# EAGLE design MDD (EAGLE 8.5.1)
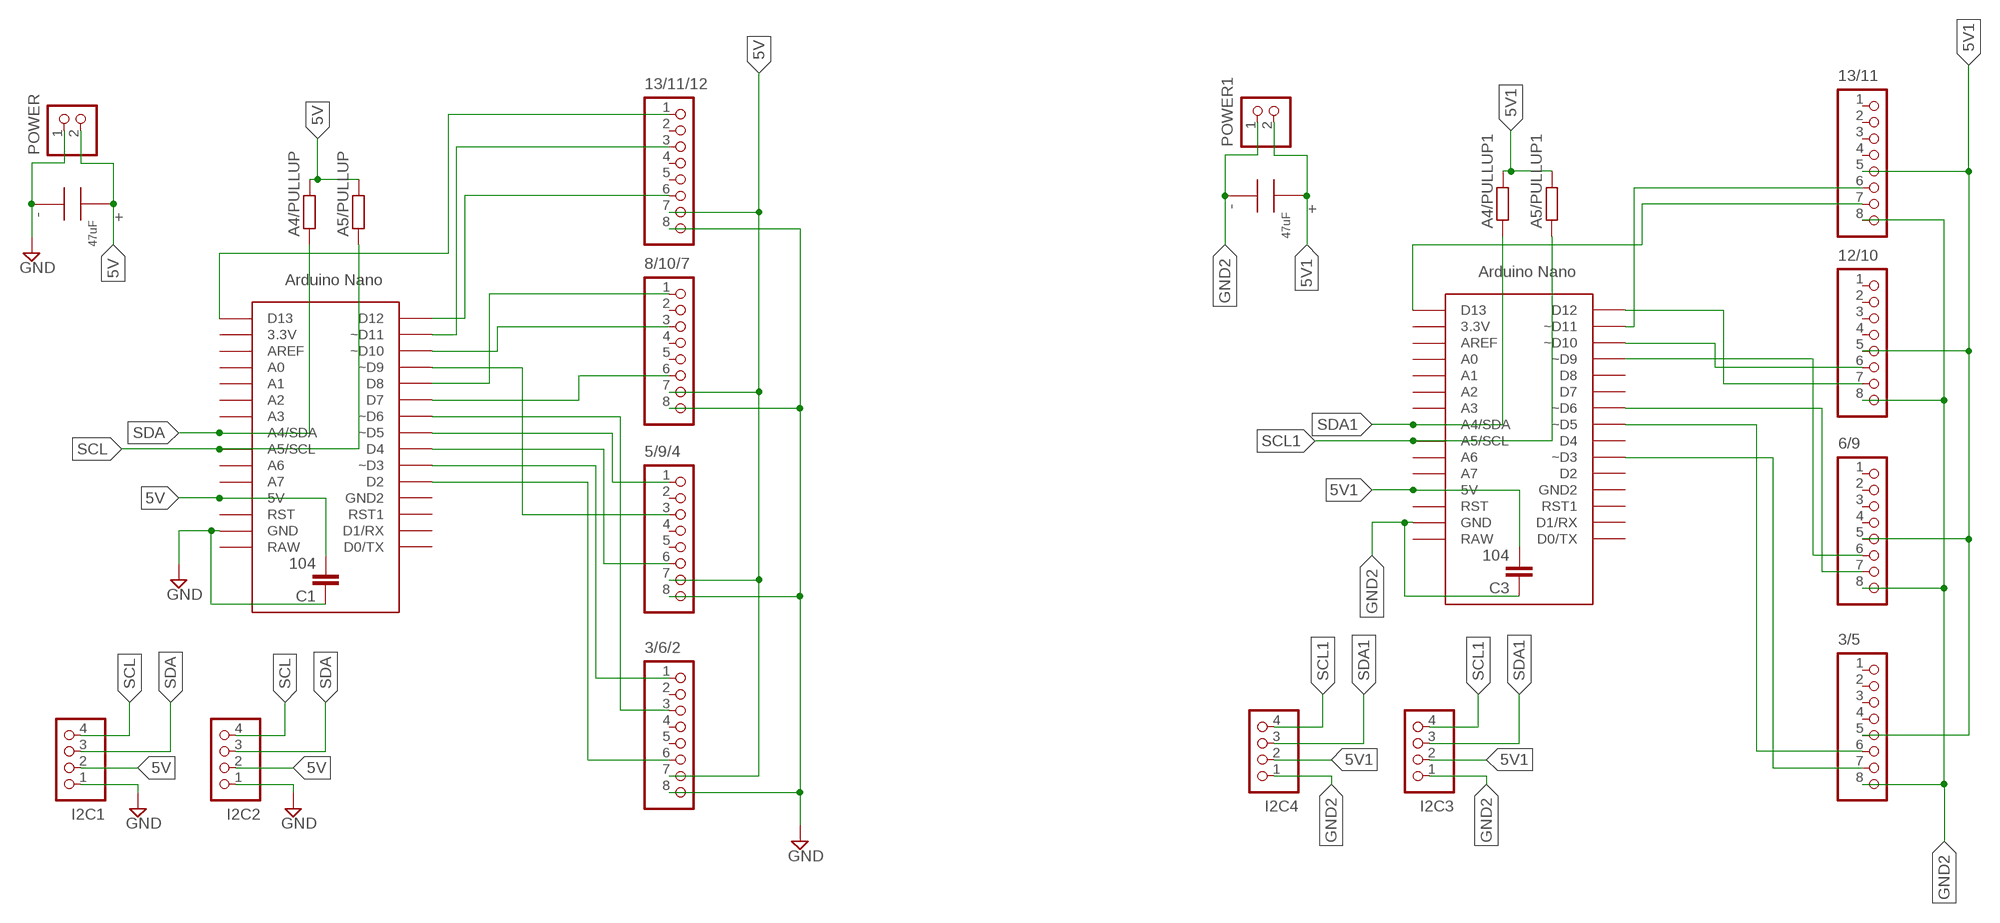
[diagram p0: schematic, sheet 1]

## Parts
3/5  B8B-XH-A  [B8B-XH-A]
3/6/2  B8B-XH-A  [B8B-XH-A]
5/9/4  B8B-XH-A  [B8B-XH-A]
6/9  B8B-XH-A  [B8B-XH-A]
8/10/7  B8B-XH-A  [B8B-XH-A]
12/10  B8B-XH-A  [B8B-XH-A]
13/11  B8B-XH-A  [B8B-XH-A]
13/11/12  B8B-XH-A  [B8B-XH-A]
A4/PULLUP  R-EU_0204/7  [0204/7]
A4/PULLUP1  R-EU_0204/7  [0204/7]
A5/PULLUP  R-EU_0204/7  [0204/7]
A5/PULLUP1  R-EU_0204/7  [0204/7]
C1  104  C2.5/2  [C2.5-2]
C2  47uF  C_47UF  [C_47UF]
C3  104  C2.5/2  [C2.5-2]
C4  47uF  C_47UF  [C_47UF]
I2C1  B4B-XH-A  [B4B-XH-A]
I2C2  B4B-XH-A  [B4B-XH-A]
I2C3  B4B-XH-A  [B4B-XH-A]
I2C4  B4B-XH-A  [B4B-XH-A]
NANO  NANO  [NANO]
NANO1  NANO  [NANO]
POWER  B2B-XH-A  [B2B-XH-A]
POWER1  B2B-XH-A  [B2B-XH-A]

## Nets
5V [power]: 3/6/2.7 5/9/4.7 8/10/7.7 13/11/12.7 A4/PULLUP.2 A5/PULLUP.2 C1.2 C2.+ I2C1.2 I2C2.2 NANO.5V POWER.2(VCC)
5V1 [power]: 3/5.5 6/9.5 12/10.5 13/11.5 A4/PULLUP1.2 A5/PULLUP1.2 C3.2 C4.+ I2C3.2 I2C4.2 NANO1.5V POWER1.2(VCC)
GND [power]: 3/6/2.8 5/9/4.8 8/10/7.8 13/11/12.8 C1.1 C2.- I2C1.1 I2C2.1 NANO.GND POWER.1(GND)
GND2 [power]: 3/5.8 6/9.8 12/10.8 13/11.8 C3.1 C4.- I2C3.1 I2C4.1 NANO1.GND POWER1.1(GND)
N$1: 13/11/12.1 NANO.D13
N$2: 13/11/12.3 NANO.D11(~D11)
N$3: 13/11/12.6 NANO.D12
N$4: 8/10/7.3 NANO.D10(~D10)
N$5: 8/10/7.1 NANO.D8
N$6: 5/9/4.3 NANO.D9(~D9)
N$7: 8/10/7.6 NANO.D7
N$8: 3/6/2.3 NANO.D6(~D6)
N$9: 5/9/4.1 NANO.D5(~D5)
N$10: 5/9/4.6 NANO.D4
N$11: 3/6/2.1 NANO.D3(~D3)
N$12: 3/6/2.6 NANO.D2
N$13: 13/11.7 NANO1.D13
N$14: 6/9.7 NANO1.D6(~D6)
N$16: 3/5.7 NANO1.D3(~D3)
N$17: 3/5.6 NANO1.D5(~D5)
N$18: 6/9.6 NANO1.D9(~D9)
N$19: 12/10.6 NANO1.D10(~D10)
N$20: 12/10.7 NANO1.D12
N$21: 13/11.6 NANO1.D11(~D11)
SCL: A5/PULLUP.1 I2C1.4 I2C2.4 NANO.A5(A5/SCL)
SCL1: A5/PULLUP1.1 I2C3.4 I2C4.4 NANO1.A5(A5/SCL)
SDA: A4/PULLUP.1 I2C1.3 I2C2.3 NANO.A4(A4/SDA)
SDA1: A4/PULLUP1.1 I2C3.3 I2C4.3 NANO1.A4(A4/SDA)
Unconnected: 3/5.1 3/5.2 3/5.3 3/5.4 3/6/2.2 3/6/2.4 3/6/2.5 5/9/4.2 5/9/4.4 5/9/4.5 6/9.1 6/9.2 6/9.3 6/9.4 8/10/7.2 8/10/7.4 8/10/7.5 12/10.1 12/10.2 12/10.3 12/10.4 13/11.1 13/11.2 13/11.3 13/11.4 13/11/12.2 13/11/12.4 13/11/12.5 NANO1.3.3V NANO1.A0 NANO1.A1 NANO1.A2 NANO1.A3 NANO1.A6 NANO1.A7 NANO1.AREF NANO1.D2 NANO1.D4 NANO1.D7 NANO1.D8 NANO1.GND1(GND2) NANO1.RAW NANO1.RST NANO1.RST1 NANO1.RX1(D1/RX) NANO1.TX0(D0/TX) NANO.3.3V NANO.A0 NANO.A1 NANO.A2 NANO.A3 NANO.A6 NANO.A7 NANO.AREF NANO.GND1(GND2) NANO.RAW NANO.RST NANO.RST1 NANO.RX1(D1/RX) NANO.TX0(D0/TX)

## Library data of the parts
3/5 3/6/2 5/9/4 6/9 8/10/7 12/10 13/11 13/11/12 = jst-xh:B8B-XH-A: Wire-to-Board 2.5mm pitch top mount connector Source: http://www.jst-mfg.com/product/pdf/jpn/XH.pdf http://www.jst-mfg.com/product/detail.php?series=277
A4/PULLUP A4/PULLUP1 A5/PULLUP A5/PULLUP1 = resistor:R-EU_: RESISTOR, European symbol
C1 C3 = capacitor-wima:C: CAPACITOR naming: grid - package width
C2 C4 = c_47uF:C_47UF: 47uF
I2C1-I2C4 = jst-xh:B4B-XH-A: Wire-to-Board 2.5mm pitch top mount connector Source: http://www.jst-mfg.com/product/pdf/jpn/XH.pdf http://www.jst-mfg.com/product/detail.php?series=277
NANO NANO1 = Arduino-clone:NANO: Arduino Nano
POWER POWER1 = jst-xh:B2B-XH-A: Wire-to-Board 2.5mm pitch top mount connector Source: http://www.jst-mfg.com/product/pdf/jpn/XH.pdf http://www.jst-mfg.com/product/detail.php?series=277

## Net classes
0 default: width 0.3 mm
1 power: width 0.5 mm

## Board
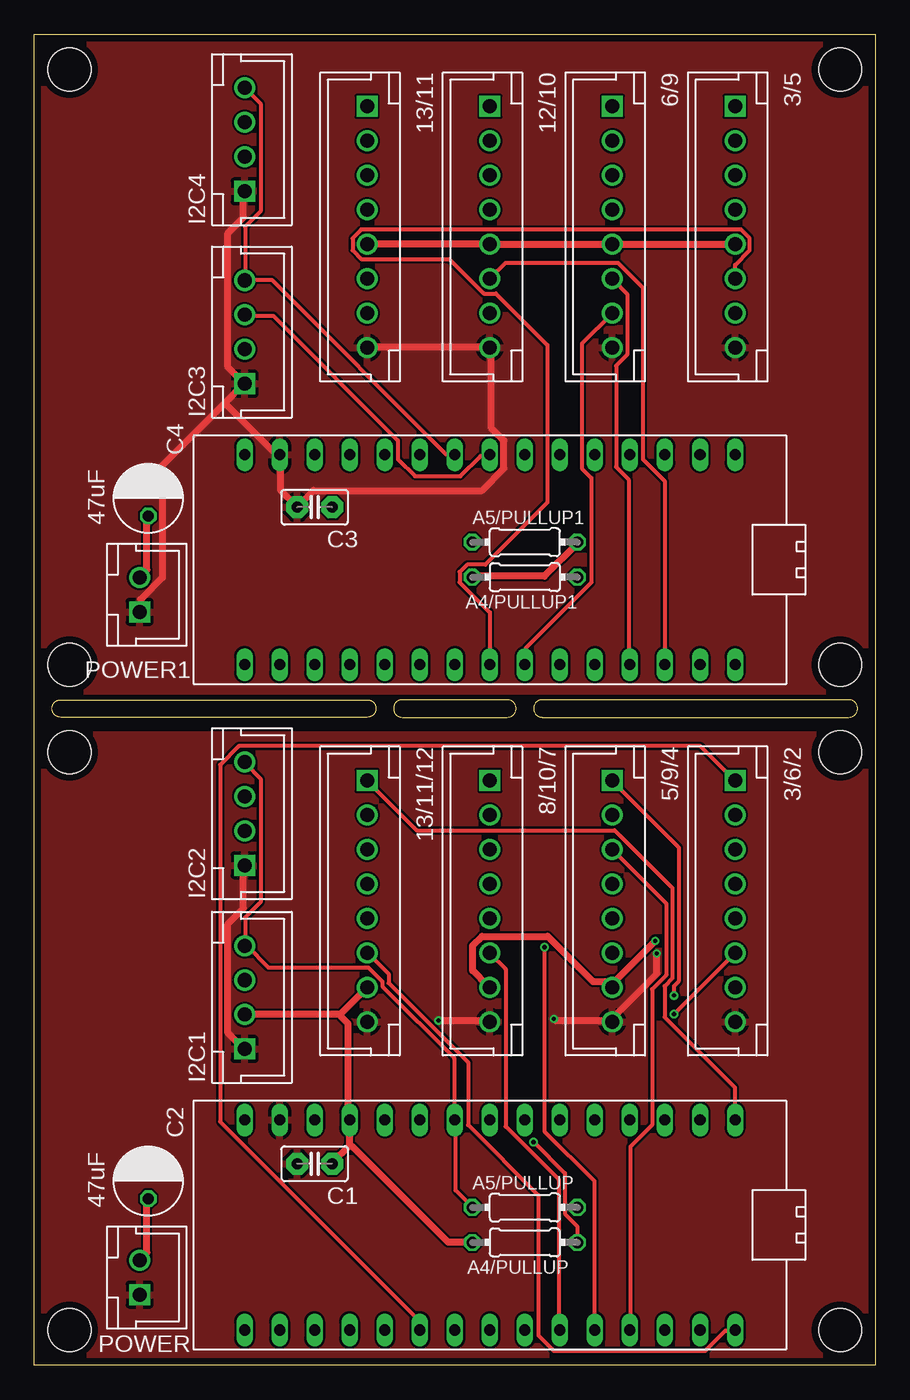
[diagram p1: board, top side]
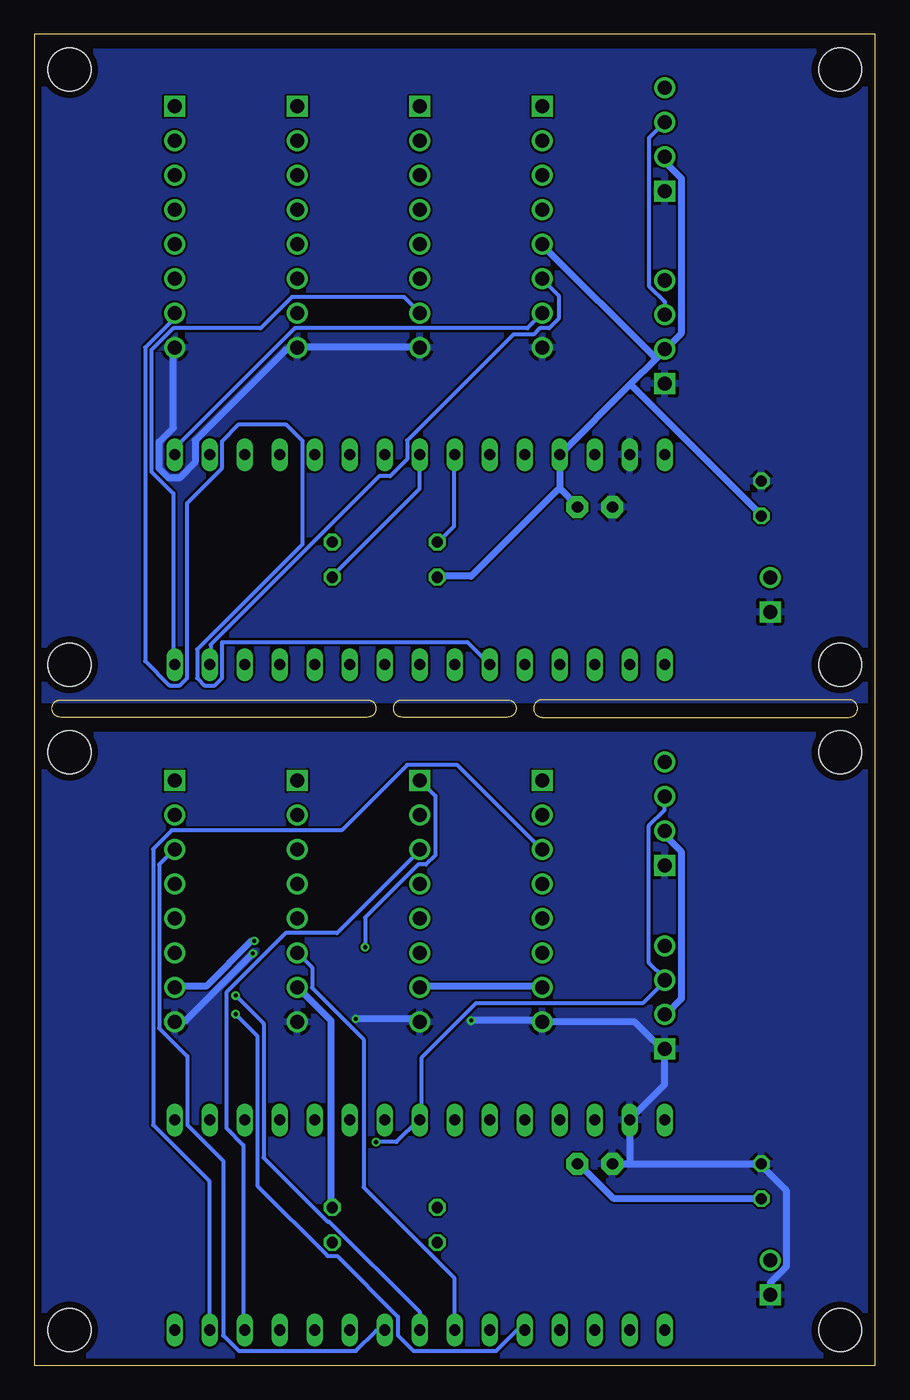
[diagram p2: board, bottom side, seen from below]

Size 60.96 x 96.52 mm. Coordinates in mm from the lower left corner, seen from the top.
Outline: 0,0 0,96.52 60.96,96.52 60.96,0 0,0
Copper layers (1*16): Top 0.035mm / dielectric 1.6mm / Bottom 0.035mm
Design rules "Elecrow_2-layer_PCB_eagle_rule": minimum track width 6mil, minimum drill 12mil, track to track 6mil, track to pad 6mil, pad to pad 6mil, via to via 8mil, smd to smd 0mil, copper to edge 20mil, drill to drill 10mil, minimum pad ring 6mil, minimum via ring 6mil, stop-mask expansion 0mil, vias tented up to drill 100mil, thermal gap 10mil
Holes 3.1 mm at 2.54,2.54 2.54,50.8 58.42,93.98 2.54,44.45 58.42,50.8 2.54,93.98 58.42,2.54 58.42,44.45
Milling: area 1.3,47 to 24.8,48.3; area 26,47 to 34.9,48.3; area 36.2,47 to 59.7,48.3

### Footprints (pad centres in the part's own frame; a part is rotated, then mirrored left to right if it is on the bottom)
B8B-XH-A = drill 1.016 square: 1 -8.75,0 | drill 1.016: 2 -6.25,0; 3 -3.75,0; 4 -1.25,0; 5 1.25,0; 6 3.75,0; 7 6.25,0; 8 8.75,0
0204/7 = drill 0.813 octagon: 1 -3.81,0; 2 3.81,0
C2.5-2 = drill 0.813 pad 1.6 octagon: 1 -1.27,0; 2 1.27,0
C_47UF = drill 0.8 octagon: + -1.27,0; - 1.27,0
B4B-XH-A = drill 1.016 square: 1 -3.75,0 | drill 1.016: 2 -1.25,0; 3 1.25,0; 4 3.75,0
NANO = drill 0.8 long: 3.3V -7.62,15.24; 5V -7.62,-10.16; A0 -7.62,10.16; A1 -7.62,7.62; A2 -7.62,5.08; A3 -7.62,2.54; A4 -7.62,0; A5 -7.62,-2.54; A6 -7.62,-5.08; A7 -7.62,-7.62; AREF -7.62,12.7; D2 7.62,-7.62; D3 7.62,-5.08; D4 7.62,-2.54; D5 7.62,0; D6 7.62,2.54; D7 7.62,5.08; D8 7.62,7.62; D9 7.62,10.16; D10 7.62,12.7; D11 7.62,15.24; D12 7.62,17.78; D13 -7.62,17.78; GND -7.62,-15.24; GND1 7.62,-10.16; RAW -7.62,-17.78; RST -7.62,-12.7; RST1 7.62,-12.7; RX1 7.62,-15.24; TX0 7.62,-17.78
B2B-XH-A = drill 1.016 square: 1 -1.25,0 | drill 1.016: 2 1.25,0

### Placement (x,y rotation side)
3/5  50.8,82.55 270 top
3/6/2  50.8,33.66 270 top
5/9/4  41.91,33.66 270 top
6/9  41.91,82.55 270 top
8/10/7  33.02,33.66 270 top
12/10  33.02,82.55 270 top
13/11  24.13,82.55 270 top
13/11/12  24.13,33.66 270 top
A4/PULLUP  35.56,8.89 180 top
A4/PULLUP1  35.56,57.15 180 top
A5/PULLUP  35.56,11.43 0 top
A5/PULLUP1  35.56,59.69 0 top
C1  20.32,14.61 0 top
C2  8.26,13.34 90 top
C3  20.32,62.23 0 top
C4  8.26,62.87 90 top
I2C1  15.24,26.67 90 top
I2C2  15.24,40.01 90 top
I2C3  15.24,74.93 90 top
I2C4  15.24,88.9 90 top
NANO  33.02,10.16 270 top
NANO1  33.02,58.42 270 top
POWER  7.62,6.35 90 top
POWER1  7.62,55.88 90 top

### Tracks (layer width: path | path; a pad name or v marks a point on that pad's centre or on a via)
5V  (via drill 0.3)
  Top 0.5: C2.+ 8.14,11.99 8.14,8.14 7.69,7.69 POWER.2 | 22.85,15.95 22.85,17.76 NANO.5V 22.73,17.98 22.73,24.77 22.28,25.22 22.17,25.45 | 22.85,15.95 21.6,14.7 C1.2 | A4/PULLUP.2 31.67,8.94 29.97,8.94 23.07,15.83 22.85,15.95 | v45.01,30.76 41.96,27.71 41.96,27.48 5/9/4.7 41.73,27.82 40.49,27.82 37.21,31.1 32.46,31.1 31.78,30.42 31.78,28.61 32.91,27.48 8/10/7.7 | 22.17,25.45 15.27,25.45 I2C1.2 | 22.17,25.45 24.09,27.37 13/11/12.7
  Bottom 0.5: C2.+ 8.26,12.1 19,12.1 21.49,14.59 C1.2 | A5/PULLUP.2 39.47,11.54 39.47,25 41.85,27.37 5/9/4.7 | v45.01,30.76 45.24,30.76 48.52,27.48 50.78,27.48 3/6/2.7 | I2C2.2 15.15,38.68 15.15,38.34 14.02,37.21 14.02,26.58 15.15,25.45 I2C1.2 | 8/10/7.7 32.91,27.48 24.2,27.48 13/11/12.7
5V1
  Top 0.5: 13/11.5 24.2,81.32 32.91,81.32 12/10.5 33.25,81.32 41.85,81.32 6/9.5 42.07,81.32 50.78,81.32 3/5.5 | A4/PULLUP1.2 31.78,57.23 36.98,57.23 39.36,59.6 A5/PULLUP1.2 | C4.+ 8.14,61.53 8.14,57.68 7.69,57.23 POWER1.2
  Bottom 0.5: 22.85,63.56 22.85,65.94 NANO1.5V 22.73,66.16 17.76,71.14 | 22.85,63.56 21.6,62.32 C3.2 | 17.76,71.14 15.89,73.01 | 15.89,73.01 15.27,73.63 I2C3.2 15.04,73.85 14.02,74.87 14.02,86.07 15.15,87.2 15.15,87.54 I2C4.2 | 17.76,71.14 8.26,61.64 C4.+ | A4/PULLUP1.2 31.67,57.23 29.29,57.23 23.07,63.45 22.85,63.56 | 15.89,73.01 24.09,81.21 13/11.5
GND  (via drill 0.3)
  Top 0.5: I2C2.1 15.15,36.19 15.15,33.14 14.02,32.01 14.02,24.09 15.15,22.96 I2C1.1 | v29.29,25 32.91,25 8/10/7.8 | v37.66,25.11 37.77,25 41.85,25 5/9/4.8 41.96,25.22 45.13,28.39 v45.13,29.86
  Bottom 0.5: 17.76,14.59 19,14.59 C1.1 | 17.76,14.59 8.26,14.59 C2.- 8.14,14.36 6.45,12.67 6.45,7.12 7.58,5.99 7.58,5.2 POWER.1 | 17.76,14.59 17.76,17.76 NANO.GND 17.64,17.98 15.27,20.36 15.27,22.85 I2C1.1 15.49,22.96 17.42,24.88 24.09,24.88 13/11/12.8 24.32,25 v29.29,25 | v37.66,25.11 33.14,25.11 33.02,25 8/10/7.8 | v45.13,29.86 49.99,25 50.78,25 3/6/2.8
  pour Top: 0,45.72 0,0 60.96,0 60.96,45.72
  pour Bottom: 0,45.72 0,0 60.96,0 60.96,45.72
GND2
  Top 0.5: 13/11.8 24.2,73.85 32.91,73.85 12/10.8 33.14,73.63 33.14,67.97 34.04,67.07 34.04,65.03 32.46,63.45 20.25,63.45 19.23,62.43 C3.1 19,62.32 17.87,63.45 17.87,65.94 NANO1.GND 17.53,66.05 13.8,69.78 | 13.8,69.78 15.15,71.14 I2C3.1 15.04,71.37 14.02,72.38 14.02,82.11 15.15,83.24 15.15,85.05 I2C4.1 | 13.8,69.78 8.26,64.24 C4.- 8.37,63.9 9.27,63 9.27,57.12 7.69,55.53 7.69,54.74 POWER1.1
  Bottom 0.5: 12/10.8 33.02,73.85 41.85,73.85 6/9.8 42.07,73.63 42.75,73.63 49.31,67.07 49.31,65.48 50.44,64.35 51.23,64.35 51.91,65.03 51.91,66.95 50.9,67.97 50.9,73.74 3/5.8
  pour Top: 0,96.52 0,48.9 60.96,48.9 60.96,96.52
  pour Bottom (isolate 0.04): 0,95.25 0,48.26 60.96,48.26 60.96,95.25
N$1
  Top 0.3: NANO.D13 50.78,17.87 50.78,20.13 45.69,25.22 45.69,27.48 46.26,28.05 46.26,34.61 42.07,38.79 27.71,38.79 24.2,42.3 13/11/12.1
N$2
  Bottom 0.3: NANO.D11 48.29,2.6 48.29,13.35 52.37,17.42 52.37,37.44 51.01,38.79 38.68,38.79 33.93,43.54 30.31,43.54 24.2,37.44 13/11/12.3
N$3
  Top 0.3: NANO.D12 50.78,2.49 50.1,2.49 48.63,1.02 37.66,1.02 36.53,2.15 36.53,12.33 31.44,17.42 31.44,21.94 25.67,27.71 25.67,28.39 24.2,29.86 13/11/12.6
N$4
  Bottom 0.3: NANO.D10 45.81,2.6 45.81,15.95 47.05,17.19 47.05,27.03 42.75,31.33 39.02,31.33 33.02,37.32 8/10/7.3
N$5  (via drill 0.3)
  Top 0.3: v36.98,30.31 36.98,16.96 40.6,13.35 40.6,2.6 NANO.D8
  Bottom 0.3: v36.98,30.31 36.98,32.46 33.14,36.3 32.57,36.3 31.89,36.98 31.89,41.28 32.91,42.3 8/10/7.1
N$6
  Top 0.3: NANO.D9 43.2,2.6 43.2,15.83 44.79,17.42 44.79,27.26 45.81,28.27 45.81,33.48 41.96,37.32 5/9/4.3
N$7
  Top 0.3: NANO.D7 38,2.6 38,13.46 34.16,17.3 34.16,28.73 33.02,29.86 8/10/7.6
N$8
  Bottom 0.3: NANO.D6 35.63,2.49 36.19,2.49 37.66,1.02 46.15,1.02 47.28,2.15 47.28,14.82 49.88,17.42 49.88,22.39 51.91,24.43 51.91,36.3 50.9,37.32 3/6/2.3
N$9  (via drill 0.3)
  Top 0.3: v46.37,26.8 46.37,27.48 46.71,27.82 46.71,37.55 41.96,42.3 5/9/4.1
  Bottom 0.3: v46.37,26.8 44.34,24.77 44.34,15.04 39.7,10.4 39.59,10.4 33.02,3.85 33.02,2.6 NANO.D5
N$10
  Bottom 0.3: NANO.D4 30.54,2.6 30.54,6.33 37.1,12.89 37.1,23.64 40.83,27.37 40.83,28.84 41.85,29.86 5/9/4.6
N$11
  Top 0.3: NANO.D3 27.94,2.6 27.94,3.17 13.46,17.64 13.46,43.54 14.82,44.9 48.29,44.9 50.78,42.41 3/6/2.1
N$12  (via drill 0.3)
  Top 0.3: v46.37,25.45 50.78,29.86 3/6/2.6
  Bottom 0.3: v46.37,25.45 44.79,23.86 44.79,13.01 39.7,7.92 39.02,7.92 34.61,3.51 34.61,2.15 33.48,1.02 27.48,1.02 26.01,2.49 25.45,2.49 NANO.D2
N$13
  Bottom 0.3: NANO1.D13 50.78,66.05 50.78,66.5 42.07,75.21 25.22,75.21 24.2,76.23 13/11.7
N$14
  Top 0.3: NANO1.D6 35.63,50.9 35.63,52.03 40.38,56.78 40.38,64.35 39.7,65.03 39.7,74.08 41.85,76.23 6/9.7
N$16
  Bottom 0.3: 3/5.7 50.8,75.95 52.93,73.81 52.93,51.05 51.17,49.3 50.43,49.3 49.9,49.83 49.9,62.53 47.36,65.07 47.36,67.01 46.13,68.24 42.74,68.24 41.54,67.04 41.54,59.53 49.16,51.91 49.16,49.83 48.63,49.3 47.89,49.3 47.36,49.83 47.36,52.44 29.57,52.44 NANO1.D3
N$17
  Top 0.3: NANO1.D5 33.02,54.59 30.84,56.77 30.84,57.53 31.37,58.06 32.69,58.06 37.2,62.57 37.2,74 33.46,77.74 32.58,77.74 30.08,80.24 23.69,80.24 23.07,80.86 23.07,81.74 23.69,82.36 51.24,82.36 51.86,81.74 51.86,80.86 50.8,79.8 3/5.6
N$18
  Top 0.3: NANO1.D9 43.09,50.9 43.09,64.24 42.19,65.15 42.19,72.5 42.98,73.29 42.98,77.7 41.96,78.72 6/9.6
N$19
  Top 0.3: NANO1.D10 45.69,50.9 45.69,64.13 44.11,65.71 44.11,78.15 42.3,79.96 34.16,79.96 33.02,78.83 12/10.6
N$20
  Bottom 0.3: NANO1.D12 50.9,50.9 50.9,63.22 52.48,64.81 52.48,73.63 50.9,75.21 44.56,75.21 42.3,77.47 34.16,77.47 33.02,76.34 12/10.7
N$21
  Bottom 0.3: NANO1.D11 48.18,50.9 48.18,52.25 35.97,64.47 35.17,64.47 33.93,65.71 33.93,67.07 26.24,74.76 24.77,74.76 24.32,75.21 23.64,75.21 22.96,75.89 22.96,77.59 24.09,78.72 13/11.6
SCL
  Top 0.3: A5/PULLUP.1 31.67,11.54 30.54,12.67 30.54,17.76 NANO.A5 30.42,17.87 30.42,22.28 25.22,27.48 25.22,27.82 24.2,28.84 16.96,28.84 15.38,30.42 I2C1.4 15.27,30.42 15.27,32.46 16.4,33.59 16.4,42.53 15.27,43.66 I2C2.4
SCL1
  Top 0.3: I2C4.4 15.27,92.63 16.4,91.5 16.4,83.69 15.27,82.56 15.27,78.72 I2C3.4 15.38,78.72 17.19,78.72 29.86,66.05 30.42,66.05 NANO1.A5
  Bottom 0.3: NANO1.A5 30.54,65.94 30.54,60.85 31.67,59.72 A5/PULLUP1.1
SDA  (via drill 0.3)
  Top 0.3: v36.19,16.17 38.45,13.91 38.45,10.97 39.36,10.07 39.36,8.94 A4/PULLUP.1
  Bottom 0.3: v36.19,16.17 34.72,16.17 33.14,17.76 NANO.A4 32.91,17.87 32.91,22.28 28.95,26.24 16.85,26.24 15.27,27.82 I2C1.3 15.27,28.05 16.4,29.18 16.4,39.13 15.27,40.26 15.27,41.17 I2C2.3
SDA1
  Top 0.3: NANO1.A4 32.91,65.94 32.35,65.94 30.88,64.47 27.6,64.47 26.35,65.71 26.35,67.07 17.3,76.12 15.27,76.12 I2C3.3
  Bottom 0.3: NANO1.A4 33.02,65.94 33.02,63.56 39.36,57.23 A4/PULLUP1.1 | I2C3.3 15.27,76.23 15.27,77.13 16.4,78.27 16.4,89.01 15.27,90.14 I2C4.3